# Altium schematic sheet Connect.SchDoc
size A4; SheetNumber: 3; SheetTotal: 3
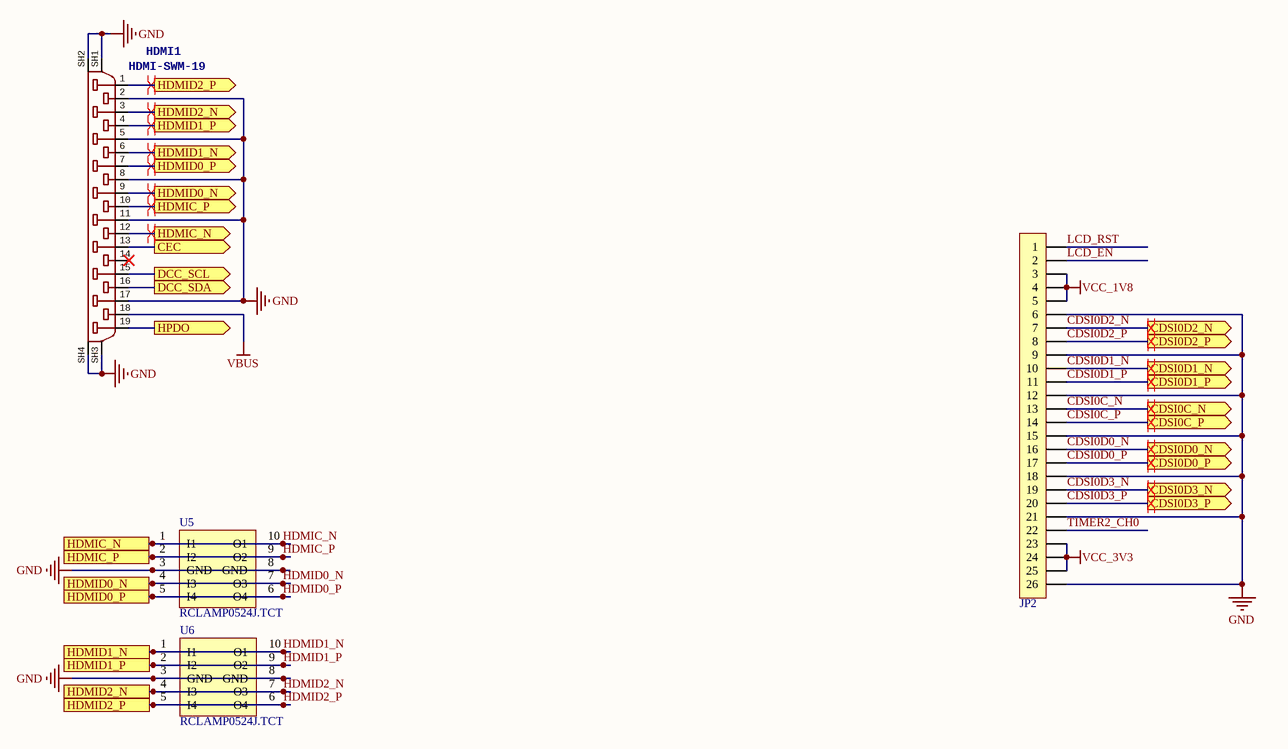
[diagram p0: Connect.SchDoc]

## Parts
HDMI1  HDMI-SWM-19  [HDMI-SWM-19]
JP2  FPC1.0-26P  [FPC0.5 2H-WS-26P]  (value not drawn)
U5  RCLAMP0524J.TCT  [RCLAMP0524J.TCT]
U6  RCLAMP0524J.TCT  [RCLAMP0524J.TCT]

## Ports
CDSI0C_N (out), CDSI0C_P (out), CDSI0D0_N (out), CDSI0D0_P (out), CDSI0D1_N (out), CDSI0D1_P (out), CDSI0D2_N (out), CDSI0D2_P (out), CDSI0D3_N (out), CDSI0D3_P (out), CEC (out), DCC_SCL (out), DCC_SDA (out), HDMIC_N, HDMIC_N (out), HDMIC_P, HDMIC_P (out), HDMID0_N, HDMID0_N (out), HDMID0_P, HDMID0_P (out), HDMID1_N, HDMID1_N (out), HDMID1_P, HDMID1_P (out), HDMID2_N, HDMID2_N (out), HDMID2_P, HDMID2_P (out), HPDO (out)

## Nets
GND: HDMI1.2 HDMI1.5 HDMI1.8 HDMI1.11 HDMI1.17 HDMI1.SH1 HDMI1.SH2 HDMI1.SH3 HDMI1.SH4 JP2.6 JP2.9 JP2.12 JP2.15 JP2.18 JP2.21 JP2.26 U5.3(GND) U5.8(GND) U6.3(GND) U6.8(GND)
VBUS: HDMI1.18
VCC_1V8: JP2.3 JP2.4 JP2.5
VCC_3V3: JP2.23 JP2.24 JP2.25
CDSI0C_N: JP2.13 ; port CDSI0C_N
CDSI0C_P: JP2.14 ; port CDSI0C_P
CDSI0D0_N: JP2.16 ; port CDSI0D0_N
CDSI0D0_P: JP2.17 ; port CDSI0D0_P
CDSI0D1_N: JP2.10 ; port CDSI0D1_N
CDSI0D1_P: JP2.11 ; port CDSI0D1_P
CDSI0D2_N: JP2.7 ; port CDSI0D2_N
CDSI0D2_P: JP2.8 ; port CDSI0D2_P
CDSI0D3_N: JP2.19 ; port CDSI0D3_N
CDSI0D3_P: JP2.20 ; port CDSI0D3_P
CEC: HDMI1.13 ; port CEC
DCC_SCL: HDMI1.15 ; port DCC_SCL
DCC_SDA: HDMI1.16 ; port DCC_SDA
HDMIC_N: HDMI1.12 U5.1(I1) U5.10(O1) ; port HDMIC_N
HDMIC_P: HDMI1.10 U5.2(I2) U5.9(O2) ; port HDMIC_P
HDMID0_N: HDMI1.9 U5.4(I3) U5.7(O3) ; port HDMID0_N
HDMID0_P: HDMI1.7 U5.5(I4) U5.6(O4) ; port HDMID0_P
HDMID1_N: HDMI1.6 U6.1(I1) U6.10(O1) ; port HDMID1_N
HDMID1_P: HDMI1.4 U6.2(I2) U6.9(O2) ; port HDMID1_P
HDMID2_N: HDMI1.3 U6.4(I3) U6.7(O3) ; port HDMID2_N
HDMID2_P: HDMI1.1 U6.5(I4) U6.6(O4) ; port HDMID2_P
HPDO: HDMI1.19 ; port HPDO
LCD_EN: JP2.2
LCD_RST: JP2.1
TIMER2_CH0: JP2.22

Not connected (* = marked no-connect by the designer): HDMI1 14*

## Layout directives
differential pair: CDSI0C_N, CDSI0C_P, CDSI0D0_N, CDSI0D0_P, CDSI0D1_N, CDSI0D1_P, CDSI0D2_N, CDSI0D2_P, CDSI0D3_N, CDSI0D3_P, HDMIC_N, HDMIC_P, HDMID0_N, HDMID0_P, HDMID1_N, HDMID1_P, HDMID2_N, HDMID2_P

## Library data of the parts
HDMI1 = HDMI-MC34931HDMI-SWM-19_1
JP2 = FPC-26P: FPC连接器; 版权归属: 源创客; BOM名称: FPC连接器; 学习资源: www.ooocke.com
U5 U6 = RCLAMP0524J.TCT: HDMI ESD保护器件 C35368